# Altium schematic sheet Robotic Claw Schematic.SchDoc
size D; SheetNumber: 1; SheetTotal: 1
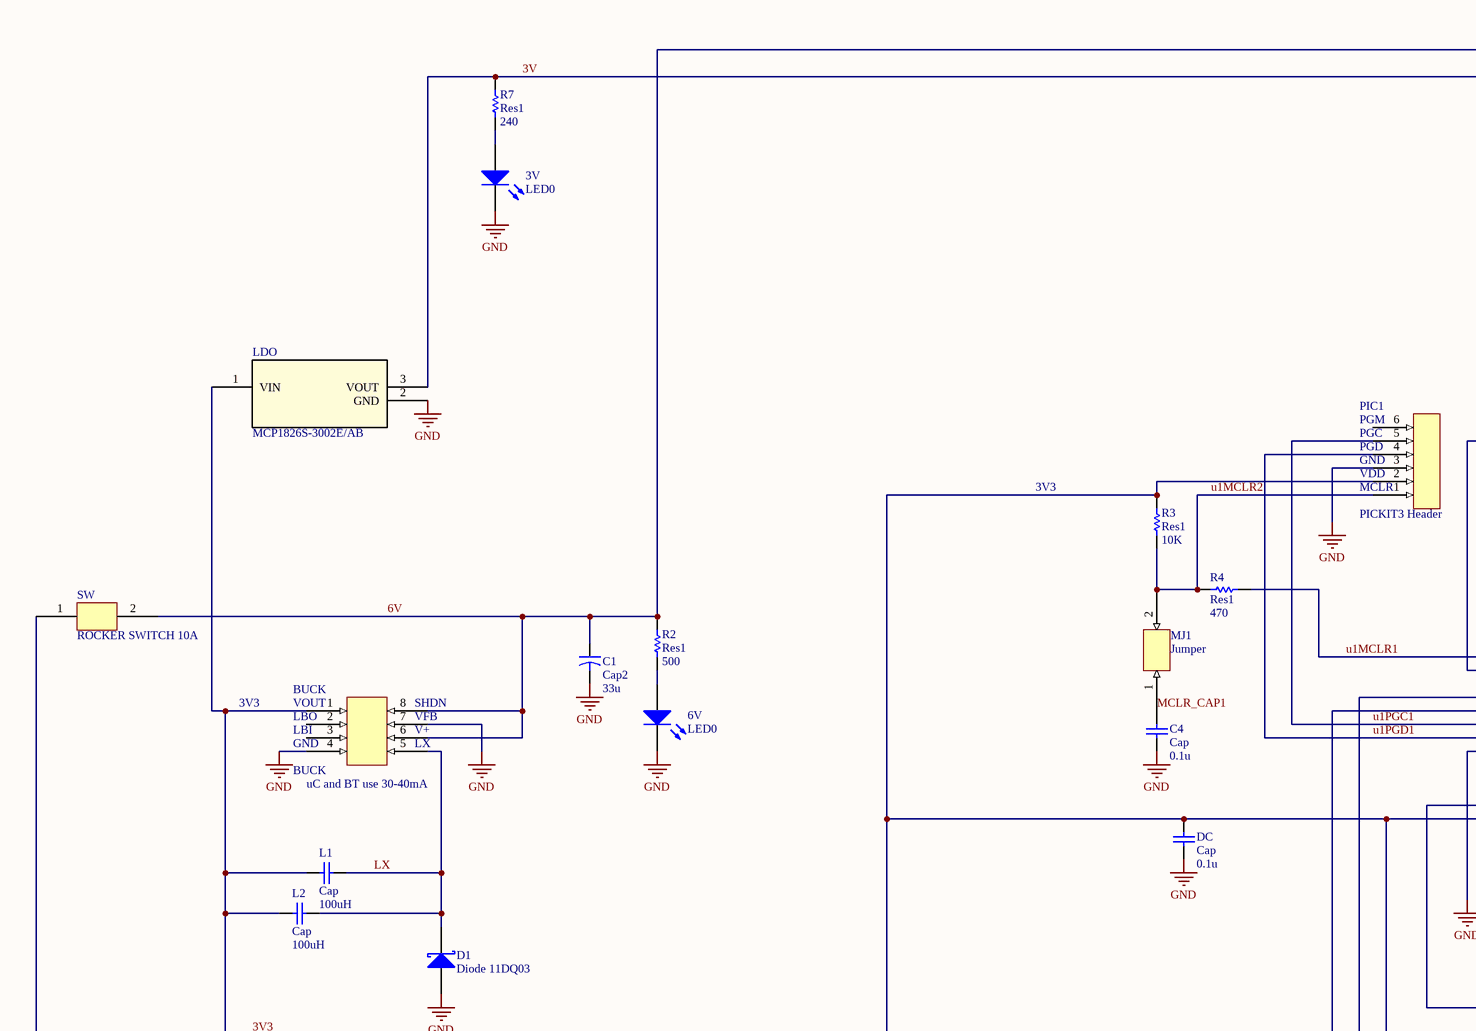
[diagram p0: Robotic Claw Schematic.SchDoc, top left]
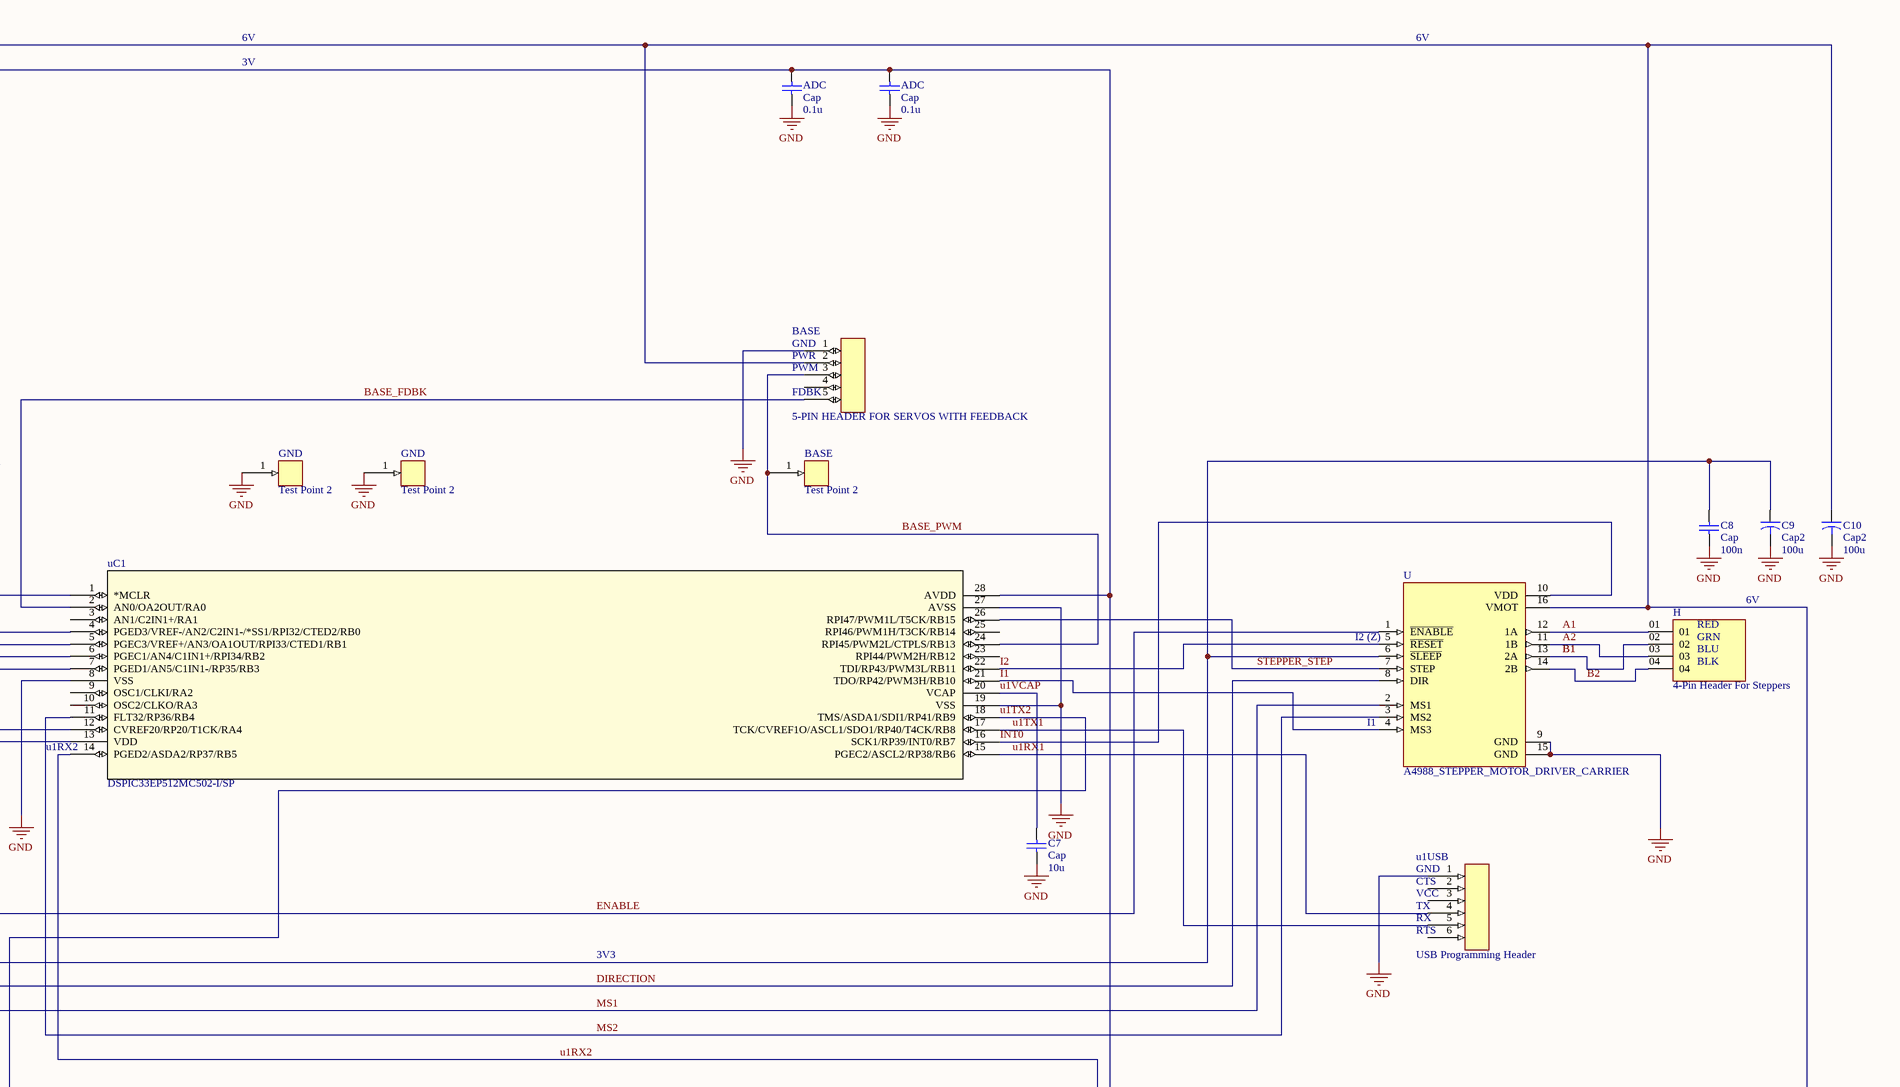
[diagram p1: Robotic Claw Schematic.SchDoc, top right]
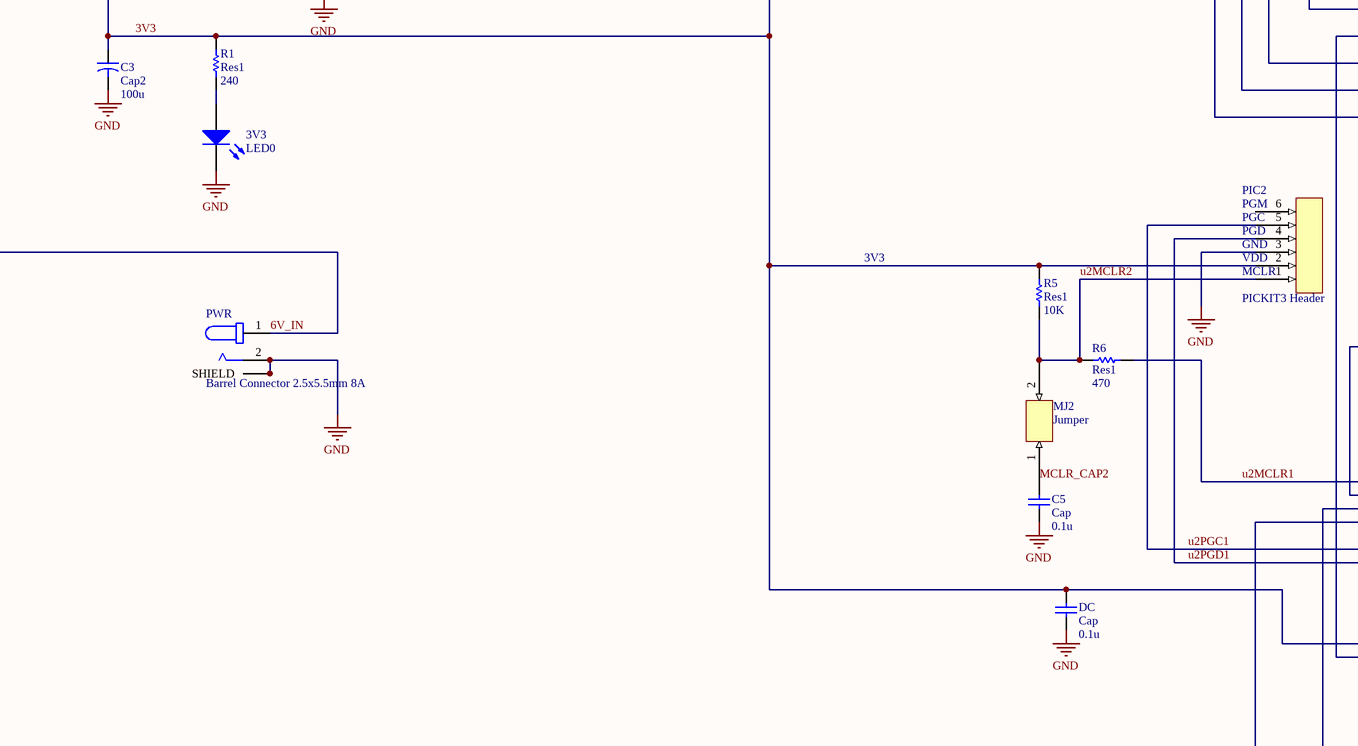
[diagram p2: Robotic Claw Schematic.SchDoc, bottom left]
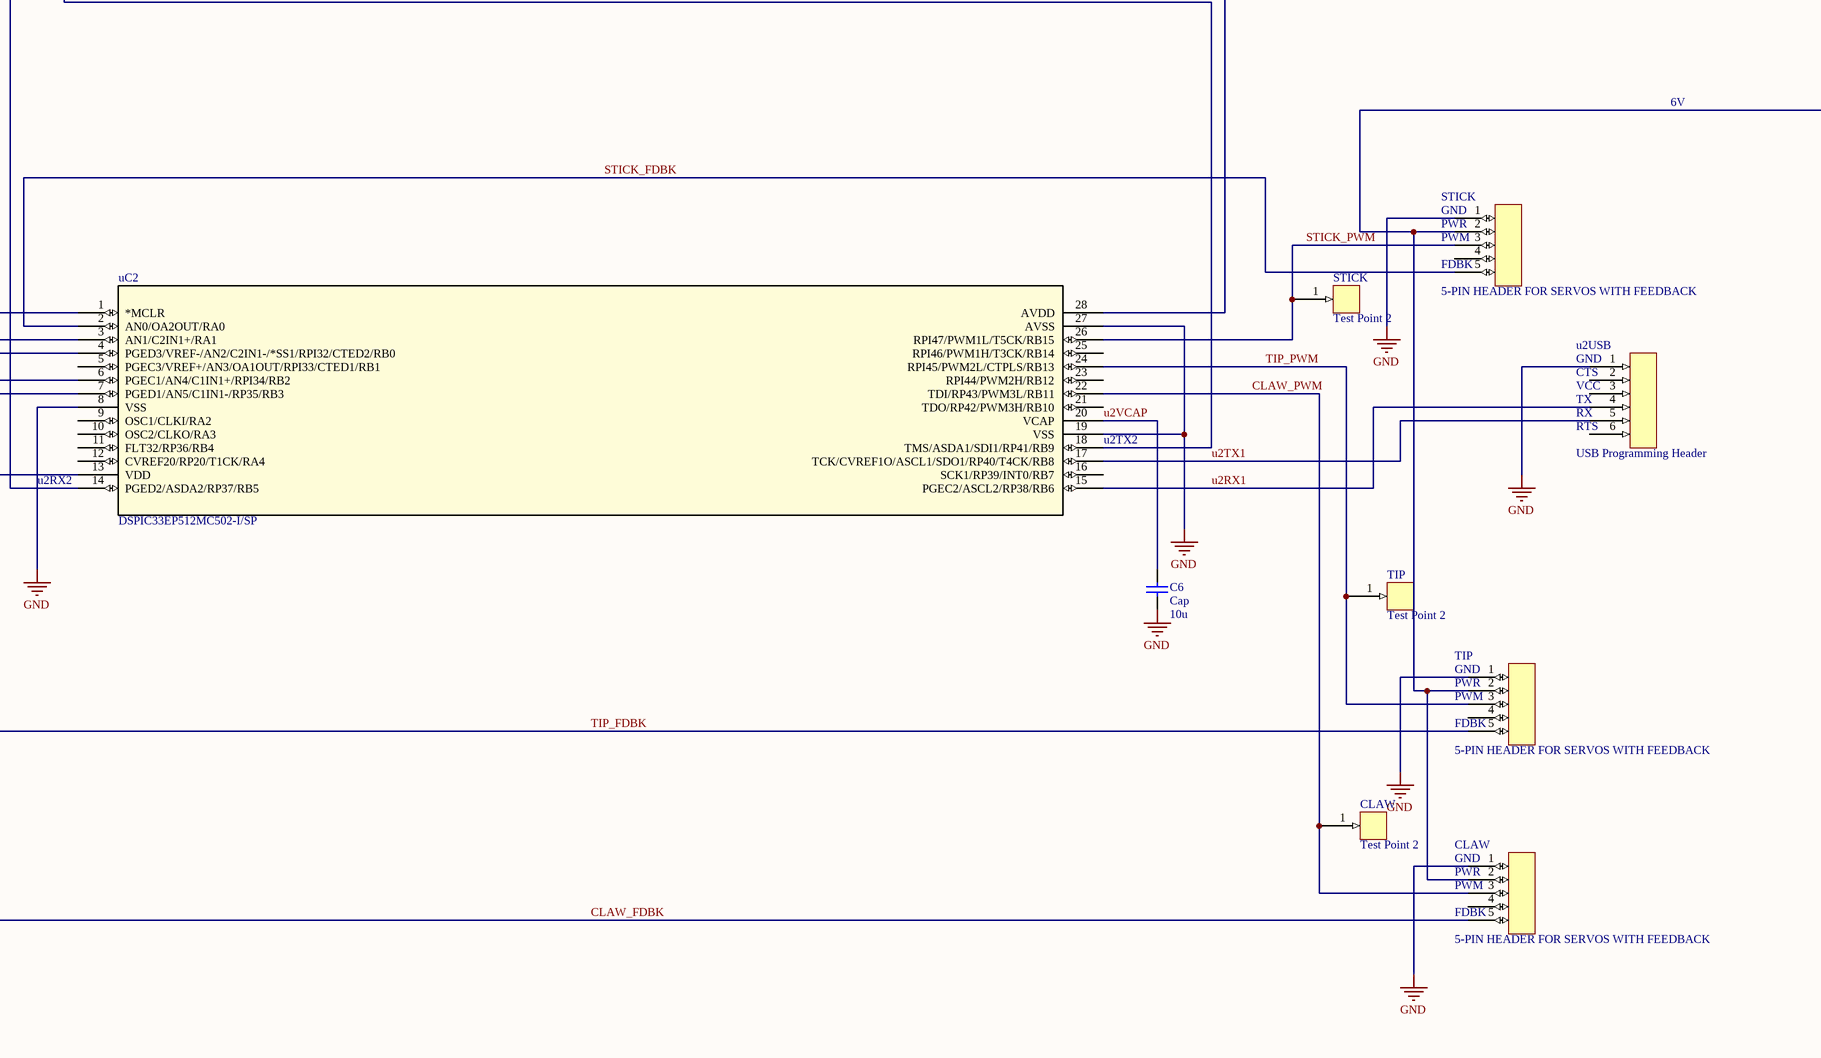
[diagram p3: Robotic Claw Schematic.SchDoc, bottom right]

## Parts
(Parts that share a designator on the sheet are numbered #1, #2 ... from top to bottom, then left to right.)
3V  LED0  [LED-0]
3V3  LED0  [LED-0]
6V  LED0  [LED-0]
ADC#1  Cap  value 0.1u  [RAD-0.3]
ADC#2  Cap  value 0.1u  [RAD-0.3]
BASE#1  5-PIN HEADER FOR SERVOS WITH FEEDBACK  [5-PIN HEADER FOR SERVOS WITH FEEDBACK]
BASE#2  Test Point 2  [Test Point2]
BUCK  BUCK  [6V TO 3V3 BUCK]
C1  Cap2  value 33u  [CAPR5-4X5]
C3  Cap2  value 100u  [CAPR5-4X5]
C4  Cap  value 0.1u  [RAD-0.3]
C5  Cap  value 0.1u  [RAD-0.3]
C6  Cap  value 10u  [RAD-0.3]
C7  Cap  value 10u  [RAD-0.3]
C8  Cap  value 100n  [RAD-0.3]
C9  Cap2  value 100u  [CAPR5-4X5]
C10  Cap2  value 100u  [CAPR5-4X5]
CLAW#1  Test Point 2  [Test Point2]
CLAW#2  5-PIN HEADER FOR SERVOS WITH FEEDBACK  [5-PIN HEADER FOR SERVOS WITH FEEDBACK]
D1  Diode 11DQ03  [DO-204AL]
DC#1  Cap  value 0.1u  [RAD-0.3]
DC#2  Cap  value 0.1u  [RAD-0.3]
GND#1  Test Point 2  [Test Point2]
GND#2  Test Point 2  [Test Point2]
H  4-Pin Header For Steppers  [4-Pin Header for Steppers]
L1  Cap  value 100uH  [RAD-0.3]
L2  Cap  value 100uH  [RAD-0.3]
LDO  MCP1826S-3002E/AB  [TO-220_AB_MC_MCH]
MJ1  Jumper  [JUMPER]
MJ2  Jumper  [JUMPER]
PIC1  PICKIT3 Header  [PICKIT3 Header]
PIC2  PICKIT3 Header  [PICKIT3 Header]
PWR  Barrel Connector 2.5x5.5mm 8A  [Barrel Connector 2.5x5.5mm 8A]
R1  Res1  value 240  [AXIAL-0.3]
R2  Res1  value 500  [AXIAL-0.3]
R3  Res1  value 10K  [AXIAL-0.3]
R4  Res1  value 470  [AXIAL-0.3]
R5  Res1  value 10K  [AXIAL-0.3]
R6  Res1  value 470  [AXIAL-0.3]
R7  Res1  value 240  [AXIAL-0.3]
STICK#1  5-PIN HEADER FOR SERVOS WITH FEEDBACK  [5-PIN HEADER FOR SERVOS WITH FEEDBACK]
STICK#2  Test Point 2  [Test Point2]
SW  ROCKER SWITCH 10A  [ROCKER SWITCH 10A]
TIP#1  Test Point 2  [Test Point2]
TIP#2  5-PIN HEADER FOR SERVOS WITH FEEDBACK  [5-PIN HEADER FOR SERVOS WITH FEEDBACK]
U  A4988_STEPPER_MOTOR_DRIVER_CARRIER  [MP6500 Stepper Motor Driver Carrier]
u1USB  USB Programming Header  [6 Pin Header]
u2USB  USB Programming Header  [6 Pin Header]
uC1  DSPIC33EP512MC502-I/SP  [dsPIC33EP512MC502 - duplicate]
uC2  DSPIC33EP512MC502-I/SP  [dsPIC33EP512MC502 - duplicate]

## Nets
GND: 3V.2(K) 3V3.2(K) 6V.2(K) ADC#1.1 ADC#2.1 BASE#1.1 BUCK.4 BUCK.7 C1.2 C3.2 C4.1 C5.1 C6.1 C7.1 C8.1 C9.2 C10.2 CLAW#2.1 D1.1(A) DC#1.1 DC#2.1 GND#1.1 GND#2.1 LDO.2(GND) PIC1.3 PIC2.3 PWR.2 PWR.S1(SHIELD) PWR.S2(SHIELD) STICK#1.1 TIP#2.1 U.9(GND) U.15(GND) u1USB.1 u2USB.1 uC1.8(VSS) uC1.19(VSS) uC1.27(AVSS) uC2.8(VSS) uC2.19(VSS) uC2.27(AVSS)
3V: ADC#1.2 ADC#2.2 LDO.3(VOUT) R7.2 uC1.28(AVDD) uC2.28(AVDD)
3V3: BUCK.1 C3.1 C8.2 C9.1 DC#1.2 DC#2.2 L1.2 L2.2 LDO.1(VIN) PIC1.2 PIC2.2 R1.2 R3.2 R5.2 U.6(~{SLEEP}) uC1.13(VDD) uC2.13(VDD)
6V: BASE#1.2 BUCK.6 BUCK.8 C1.1 C10.1 CLAW#2.2 R2.2 STICK#1.2 SW.2 TIP#2.2 U.16(VMOT)
6V_IN: PWR.1 SW.1
A1: H.01 U.12(1A)
A2: H.03 U.11(1B)
B1: H.02 U.13(2A)
B2: H.04 U.14(2B)
BASE_FDBK: BASE#1.5 uC1.2(AN0/OA2OUT/RA0)
BASE_PWM: BASE#1.3 BASE#2.1 uC1.24(RPI45/PWM2L/CTPLS/RB13)
CLAW_FDBK: CLAW#2.5 uC2.4(PGED3/VREF-/AN2/C2IN1-/*SS1/RPI32/CTED2/RB0)
CLAW_PWM: CLAW#1.1 CLAW#2.3 uC2.22(TDI/RP43/PWM3L/RB11)
DIRECTION: U.8(DIR) uC1.4(PGED3/VREF-/AN2/C2IN1-/*SS1/RPI32/CTED2/RB0)
ENABLE: U.1(~{ENABLE}) uC1.12(CVREF20/RP20/T1CK/RA4)
I1: U.4(MS3) uC1.21(TDO/RP42/PWM3H/RB10)
I2: U.5(~{RESET}) uC1.22(TDI/RP43/PWM3L/RB11)
INT0: U.10(VDD) uC1.16(SCK1/RP39/INT0/RB7)
LX: BUCK.5 D1.2(K) L1.1 L2.1
MCLR_CAP1: C4.2 MJ1.1
MCLR_CAP2: C5.2 MJ2.1
MS1: U.2(MS1) uC1.5(PGEC3/VREF+/AN3/OA1OUT/RPI33/CTED1/RB1)
MS2: U.3(MS2) uC1.11(FLT32/RP36/RB4)
STEPPER_STEP: U.7(STEP) uC1.26(RPI47/PWM1L/T5CK/RB15)
STICK_FDBK: STICK#1.5 uC2.2(AN0/OA2OUT/RA0)
STICK_PWM: STICK#1.3 STICK#2.1 uC2.26(RPI47/PWM1L/T5CK/RB15)
TIP_FDBK: TIP#2.5 uC2.3(AN1/C2IN1+/RA1)
TIP_PWM: TIP#1.1 TIP#2.3 uC2.24(RPI45/PWM2L/CTPLS/RB13)
u1MCLR1: R4.1 uC1.1(*MCLR)
u1MCLR2: MJ1.2 PIC1.1 R3.1 R4.2
u1PGC1: PIC1.5 uC1.6(PGEC1/AN4/C1IN1+/RPI34/RB2)
u1PGD1: PIC1.4 uC1.7(PGED1/AN5/C1IN1-/RP35/RB3)
u1RX1: u1USB.4 uC1.15(PGEC2/ASCL2/RP38/RB6)
u1RX2: uC1.14(PGED2/ASDA2/RP37/RB5) uC2.18(TMS/ASDA1/SDI1/RP41/RB9)
u1TX1: u1USB.5 uC1.17(TCK/CVREF1O/ASCL1/SDO1/RP40/T4CK/RB8)
u1TX2: uC1.18(TMS/ASDA1/SDI1/RP41/RB9) uC2.14(PGED2/ASDA2/RP37/RB5)
u1VCAP: C7.2 uC1.20(VCAP)
u2MCLR1: R6.1 uC2.1(*MCLR)
u2MCLR2: MJ2.2 PIC2.1 R5.1 R6.2
u2PGC1: PIC2.5 uC2.6(PGEC1/AN4/C1IN1+/RPI34/RB2)
u2PGD1: PIC2.4 uC2.7(PGED1/AN5/C1IN1-/RP35/RB3)
u2RX1: u2USB.4 uC2.15(PGEC2/ASCL2/RP38/RB6)
u2TX1: u2USB.5 uC2.17(TCK/CVREF1O/ASCL1/SDO1/RP40/T4CK/RB8)
u2VCAP: C6.2 uC2.20(VCAP)
Net3V3_1: 3V3.1(A) R1.1
Net3V_1: 3V.1(A) R7.1
Net6V_1: 6V.1(A) R2.1

Not connected (* = marked no-connect by the designer): BASE#1 4; BUCK 2 3; CLAW#2 4; PIC1 6; PIC2 6; STICK#1 4; TIP#2 4; u1USB 2 3 6; u2USB 2 3 6; uC1 3(AN1/C2IN1+/RA1) 9(OSC1/CLKI/RA2) 10(OSC2/CLKO/RA3) 23(RPI44/PWM2H/RB12) 25(RPI46/PWM1H/T3CK/RB14); uC2 5(PGEC3/VREF+/AN3/OA1OUT/RPI33/CTED1/RB1) 9(OSC1/CLKI/RA2) 10(OSC2/CLKO/RA3) 11(FLT32/RP36/RB4) 12(CVREF20/RP20/T1CK/RA4) 16(SCK1/RP39/INT0/RB7) 21(TDO/RP42/PWM3H/RB10) 23(RPI44/PWM2H/RB12) 25(RPI46/PWM1H/T3CK/RB14)

## Notes on the sheet
- 3V
- 6V
- 3V3
- (near U) I2 (Z)
- (near BUCK) uC and BT use 30-40mA
- (near U) I1
- (near uC1) u1RX2
- (near uC2) u2TX2
- (near uC2) u2RX2
- (in symbol 4-Pin Header For Steppers) RED; GRN; BLU; BLK
- (in symbol 5-PIN HEADER FOR SERVOS WITH FEEDBACK) GND; PWR; PWM; FDBK
- (in symbol BUCK) VOUT; SHDN; LBO; VFB; LBI; V+; GND; LX
- (in symbol PICKIT3 Header) PGM; PGC; PGD; GND; VDD; MCLR
- (in symbol USB Programming Header) GND; CTS; VCC; TX; RX; RTS

## Library data of the parts
3V 3V3 6V = LED0: Typical INFRARED GaAs LED; Published: 8-Jun-2000; LatestRevisionDate: 08-Jul-2005; LatestRevisionNote: Mech Layer 1 removed.; PackageReference: LED-0; Publisher: Altium Limited; PackageDescription: LED; 2 Leads
ADC#1 ADC#2 C4-C8 DC#1 DC#2 L1 L2 = Cap: Capacitor; Published: 8-Jun-2000; LatestRevisionDate: 17-Jul-2002; LatestRevisionNote: Re-released for DXP Platform.; PackageReference: RAD-0.3; Publisher: Altium Limited; PackageDescription: Radial Cap, Thru-Hole; 2 Leads; 0.3 in Pin Spacing
BASE#1 CLAW#2 STICK#1 TIP#2 = 5-PIN HEADER FOR SERVOS WITH FEEDBACK: Fourth pin is disconnected.
C1 C3 C9 C10 = Cap2: Capacitor; Published: 23-Sep-2002; PackageReference: CAPR5-4X5; Publisher: Altium Limited; PackageDescription: Capacitor; 2 Leads
D1 = Diode 11DQ03: Schottky Rectifier; Published: 8-Jun-2000; LatestRevisionDate: 17-Jul-2002; LatestRevisionNote: Re-released for DXP Platform.; DatasheetVersion: Dec-1997; PackageReference: DO-204AL; Publisher: Altium Limited; PackageDescription: Diode, Axial; Body 5.2 x 2.7 mm (LxDia. max), Lead Dia. 0.86 mm (max); Code_JEDEC: DO-204-AL; ComponentLink1Description: Manufacturer Link; ComponentLink1URL: http://www.irf.com/; ComponentLink2Description: Datasheet; ComponentLink2URL: http://www.irf.com/product-info/datasheets/data/11dq03.pdf
H = 4-Pin Header For Steppers: TSW - Samtec 2.54mm Pin Header 11.30mm Overall Pin Length (23) - Fast Stock; MP: TSW-104-23-S-S; Value: *; Check_prices: https://www.snapeda.com/parts/TSW-104-23-S-S/Samtec/view-part/2892034/?ref=eda; Package: None; MF: Samtec; Price: None; Availability: In Stock; SnapEDA_Link: https://www.snapeda.com/parts/TSW-104-23-S-S/Samtec/view-part/2892034/?ref=snap; Purchase-URL: https://pricing.snapeda.com/search/part/TSW-104-23-S-S/?ref=eda
LDO = MCP1826S-3002E/AB: No Description Available; Vendor: Microchip; Built_By: EMA_Jessica; SourceLibrary: Microchip_2019-08-23_21; Manufacturer_Part_Number: MCP1826S-3002E/AB; Copyright: Copyright (C) 2018 Accelerated Designs. All rights reserved; RefDes: RefDes; Type: DEV
PWR = Barrel Connector 2.5x5.5mm 8A: 2.5 x 5.5 mm, 8.0 A, / CUI Devices PJ-063BH; Price: None; SnapEDA_Link: https://www.snapeda.com/parts/PJ-063BH/CUI%20Devices/view-part/703426/?ref=snap; MP: PJ-063BH; Availability: Unavailable; Value: *; Package: None; MF: CUI Devices
R1-R7 = Res1: Resistor; Published: 8-Jun-2000; LatestRevisionDate: 17-Jul-2002; LatestRevisionNote: Re-released for DXP Platform.; PackageReference: AXIAL-0.3; Publisher: Altium Limited; PackageDescription: Axial Device, Thru-Hole; 2 Leads; 0.3 in Pin Spacing
SW = ROCKER SWITCH 10A: SWITCH COMPONENTS RF1-1A-DC-2-B
U = A4988_STEPPER_MOTOR_DRIVER_CARRIER: Stepper Motor Driver; MP: A4988 STEPPER MOTOR DRIVER CARRIER; MF: Pololu; Availability: Unavailable; Price: None; Package: None; Value: *; SnapEDA_Link: https://www.snapeda.com/parts/A4988%20STEPPER%20MOTOR%20DRIVER%20CARRIER/Pololu/view-part/1499394/?ref=snap
uC1 uC2 = DSPIC33EP512MC502-I/SP: 28-Pin DIP; Mfr_Name: Microchip; Copyright: Copyright (C) 2022 Ultra Librarian. All rights reserved.; Manufacturer_Part_Number: DSPIC33EP512MC502-I/SP; Digi-Key_Part_Number_1: DSPIC33EP512MC502-I/SP-ND; RefDes: RefDes; Type: DEV